# EAGLE design ECG (EAGLE 9.3.0)
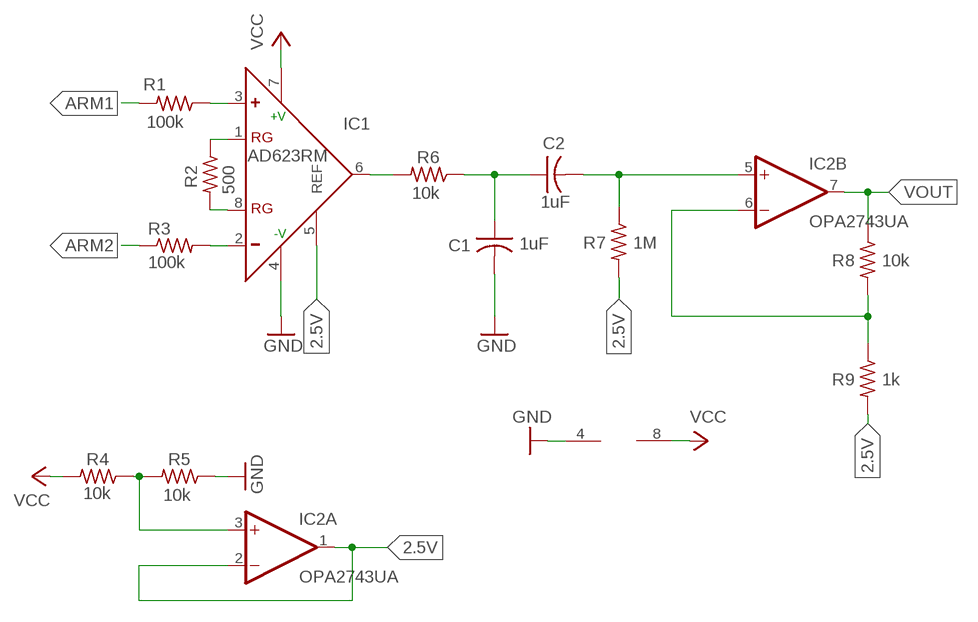
[diagram p0: schematic, sheet 1]

## Parts
C1  1uF  C-USC0805  [C0805]
C2  1uF  C-USC0805  [C0805]
IC1  AD623RM  [MSOP08]
IC2  OPA2743UA  [SOIC8]
R1  100k  R-US_R0805  [R0805]
R2  500  R-US_R0805  [R0805]
R3  100k  R-US_R0805  [R0805]
R4  10k  R-US_R0805  [R0805]
R5  10k  R-US_R0805  [R0805]
R6  10k  R-US_R0805  [R0805]
R7  1M  R-US_R0805  [R0805]
R8  10k  R-US_R0805  [R0805]
R9  1k  R-US_R0805  [R0805]

## Nets
2.5V: IC1.5(REF) IC2.1(A:OUT) IC2.2(A:-IN) R7.2 R9.2
ARM1: R1.2
ARM2: R3.1
GND: C1.2 IC1.4(-V) IC2.4(P:V-) R5.1
N$1: IC1.3(+) R1.1
N$2: IC1.1(RG) R2.1
N$3: IC1.8(RG) R2.2
N$4: IC1.2(-) R3.2
N$5: IC2.3(A:+IN) R4.1 R5.2
N$6: C2.2 IC2.5(B:+IN) R7.1
N$7: IC1.6(OUT) R6.2
N$8: C1.1 C2.1 R6.1
N$10: IC2.6(B:-IN) R8.2 R9.1
VCC: IC1.7(+V) IC2.8(P:V+) R4.2
VOUT: IC2.7(B:OUT) R8.1

## Library data of the parts
C1 C2 = rcl:C-US: CAPACITOR, American symbol; SPICEPREFIX: C
IC1 = analog-devices:AD623: Single-Supply, Rail-to-Rail, Low Cost Instrumentation Amplifier Source: http://www.analog.com/static/imported-files/data_sheets/AD623.pdf; MPN: AD623ARMZ; OC_FARNELL: 1660961; OC_NEWARK: 19M8824
IC2 = linear:OPA2743: 12V, 7MHz, CMOS, Rail-to-Rail I/O Dual OP AMP Source: http://focus.ti.com/lit/ds/sbos201/sbos201.pdf
R1-R9 = rcl:R-US_: RESISTOR, American symbol; SPICEPREFIX: R

## Board
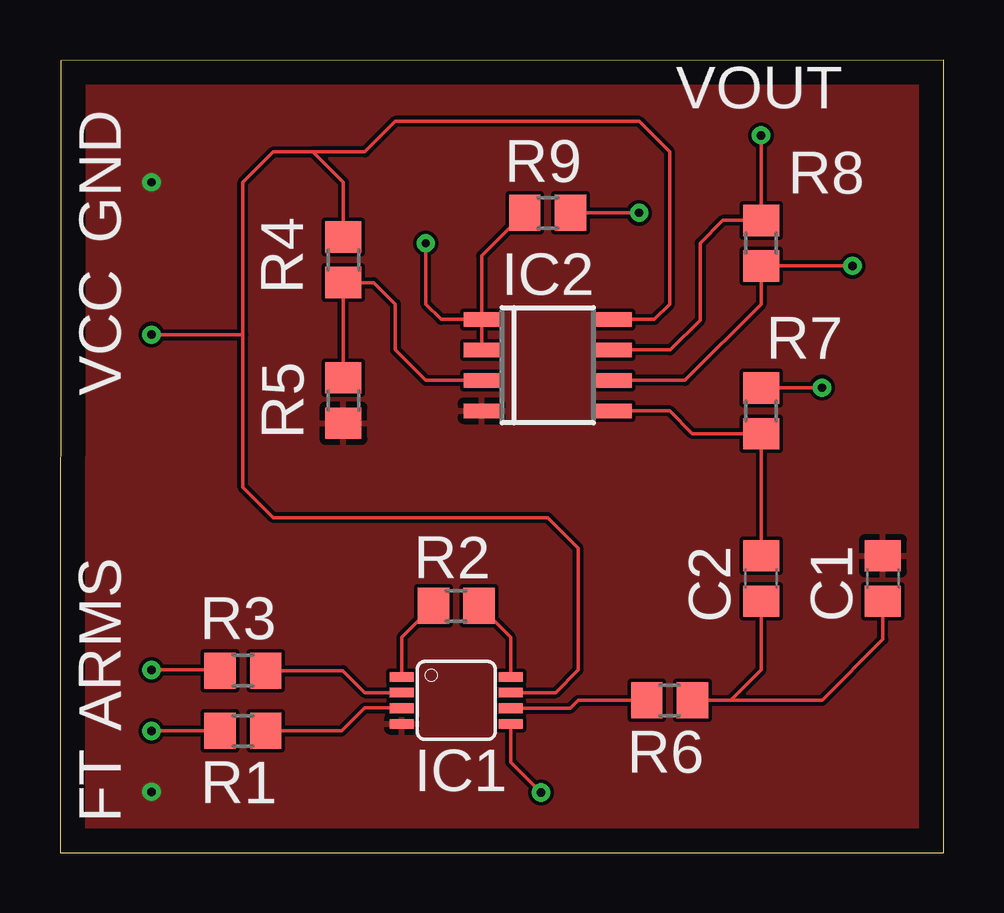
[diagram p1: board, top side]
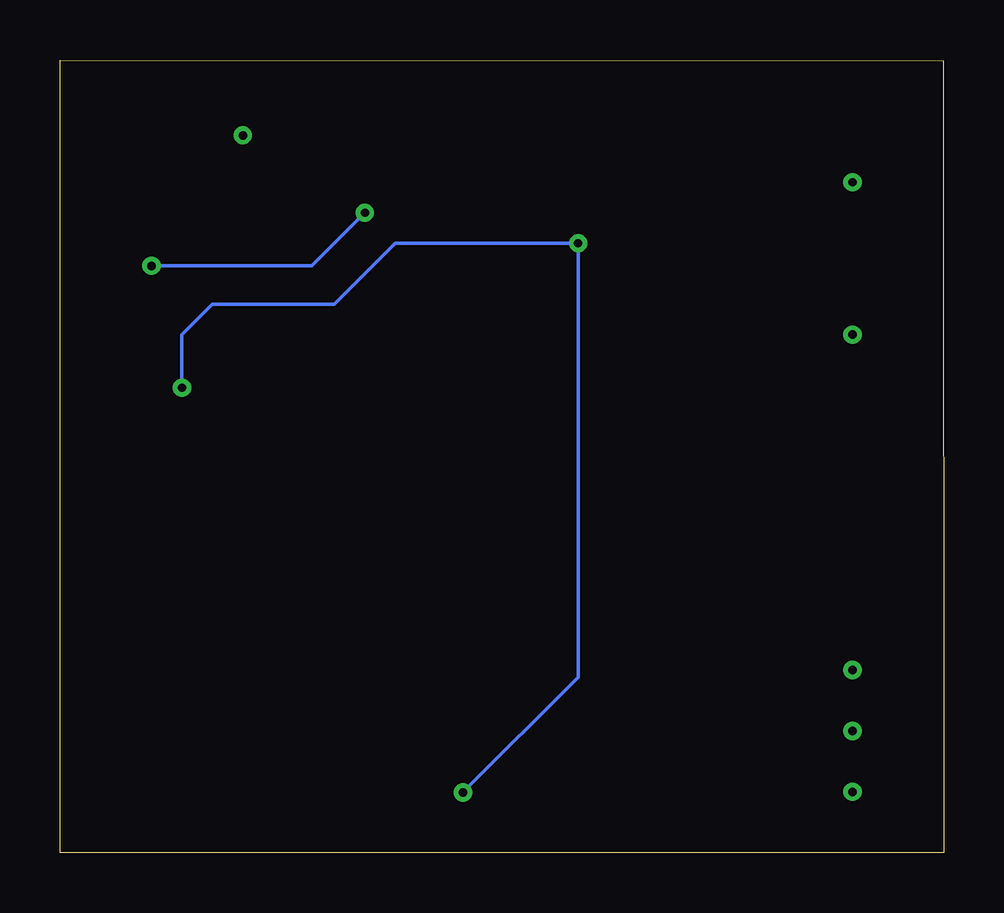
[diagram p2: board, bottom side, seen from below]

Size 36.83 x 33.04 mm. Coordinates in mm from the lower left corner, seen from the top.
Outline: 0,0 36.83,0 36.83,33.03 0.03,33.01 0,0
Copper layers (1*16): Top 0.035mm / dielectric 1.5mm / Bottom 0.035mm
Design rules "default *": minimum track width 6mil, minimum drill 10mil, track to track 6mil, track to pad 6mil, pad to pad 6mil, via to via 6mil, smd to smd 6mil, copper to edge 40mil, drill to drill 6mil, minimum pad ring 10mil, minimum via ring 8mil, stop-mask expansion 4mil, vias tented up to drill 0mil, thermal gap 10mil

### Footprints (pad centres in the part's own frame; a part is rotated, then mirrored left to right if it is on the bottom)
C0805 = smd 1.3 x 1.5: 1 -0.95,0; 2 0.95,0
MSOP08 = smd 0.4 x 1: 1 -0.976,-2.263; 2 -0.326,-2.263; 3 0.324,-2.263; 4 0.974,-2.263; 5 0.974,2.262; 6 0.324,2.262; 7 -0.326,2.262; 8 -0.976,2.262
SOIC8 = smd 0.6 x 1.5: 1 -1.905,-2.75; 2 -0.635,-2.75; 3 0.635,-2.75; 4 1.905,-2.75; 5 1.905,2.75; 6 0.635,2.75; 7 -0.635,2.75; 8 -1.905,2.75
R0805 = smd 1.3 x 1.5: 1 -0.95,0; 2 0.95,0

### Placement (x,y rotation side)
C1  34.29,11.43 90 top
C2  29.21,11.43 90 top
IC1  16.51,6.35 270 top
IC2  20.32,20.32 270 top
R1  7.62,5.08 180 top
R2  16.51,10.29 0 top
R3  7.62,7.59 0 top
R4  11.81,24.71 90 top
R5  11.81,18.85 90 top
R6  25.4,6.35 180 top
R7  29.21,18.41 90 top
R8  29.21,25.4 270 top
R9  20.32,26.67 180 top

### Tracks (layer width: path | path; a pad name or v marks a point on that pad's centre or on a via)
2.5V  (via drill 0.35)
  Top 0.152: IC2.1 IC2.2 | R9.2 17.57,24.87 IC2.1 | IC2.1 15.88,22.23 15.24,22.86 v15.24,25.4 | v20.04,2.52 18.77,3.78 IC1.5 | v31.75,19.38 29.23,19.38 R7.2
  Bottom 0.152: v20.04,2.52 15.24,7.32 v15.24,25.4 22.86,25.4 25.4,22.86 30.48,22.86 31.75,21.59 v31.75,19.38
ARM1  (via drill 0.35)
  Top 0.152: v3.81,5.08 R1.2
ARM2  (via drill 0.35)
  Top 0.152: v3.81,7.62 6.64,7.62 R3.1
GND  (via drill 0.35)
  other vias: 3.81,2.54 3.81,27.94
  pour Top: -1.27,34.29 38.1,34.29 38.1,-1.27 -1.27,-1.27
N$1
  Top 0.152: R1.1 11.73,5.08 12.7,6.04 14.23,6.04 IC1.3
N$2
  Top 0.152: R2.1 14.25,8.97 IC1.1
N$3
  Top 0.152: R2.2 18.77,8.97 IC1.8
N$4
  Top 0.152: R3.2 11.79,7.59 12.7,6.68 IC1.2
N$5
  Top 0.152: R5.2 R4.1 13.07,23.76 13.97,22.86 13.97,20.95 15.24,19.68 IC2.3
N$6
  Top 0.152: IC2.5 25.4,18.41 26.35,17.46 R7.1 C2.2
N$7
  Top 0.152: IC1.6 21.27,6.03 21.59,6.35 R6.2
N$8
  Top 0.152: R6.1 27.94,6.35 | 27.94,6.35 29.21,7.62 C2.1 | 27.94,6.35 31.75,6.35 34.29,8.89 C1.1
N$10  (via drill 0.35)
  Top 0.152: IC2.6 26.04,19.68 29.21,22.86 R8.2 v33.02,24.46 | R9.1 v24.13,26.67
  Bottom 0.152: v24.13,26.67 26.34,24.46 v33.02,24.46
VCC  (via drill 0.35)
  Top 0.152: IC1.7 20.65,6.68 21.59,7.62 21.59,12.7 20.32,13.97 8.89,13.97 7.62,15.24 7.62,21.59 | 7.62,21.59 7.62,27.94 8.89,29.21 10.54,29.21 | 10.54,29.21 11.81,27.94 R4.2 | IC2.8 24.77,22.23 25.4,22.86 25.4,29.21 24.13,30.48 13.97,30.48 12.7,29.21 10.54,29.21 | v3.81,21.59 7.62,21.59
VOUT  (via drill 0.35)
  Top 0.152: IC2.7 25.43,20.95 26.67,22.2 26.67,25.4 27.62,26.35 R8.1 v29.21,29.9

### Text on the board
tPlace: VOUT | R9 | R8 | GND | R4 | IC2 | R7 | VCC | R5 | R2 | C2 | C1 | R3 | ARMS | IC1 | R6 | R1 | FT